# Altium schematic sheet Sheet1.SchDoc
size A; SheetNumber: 1; SheetTotal: 1
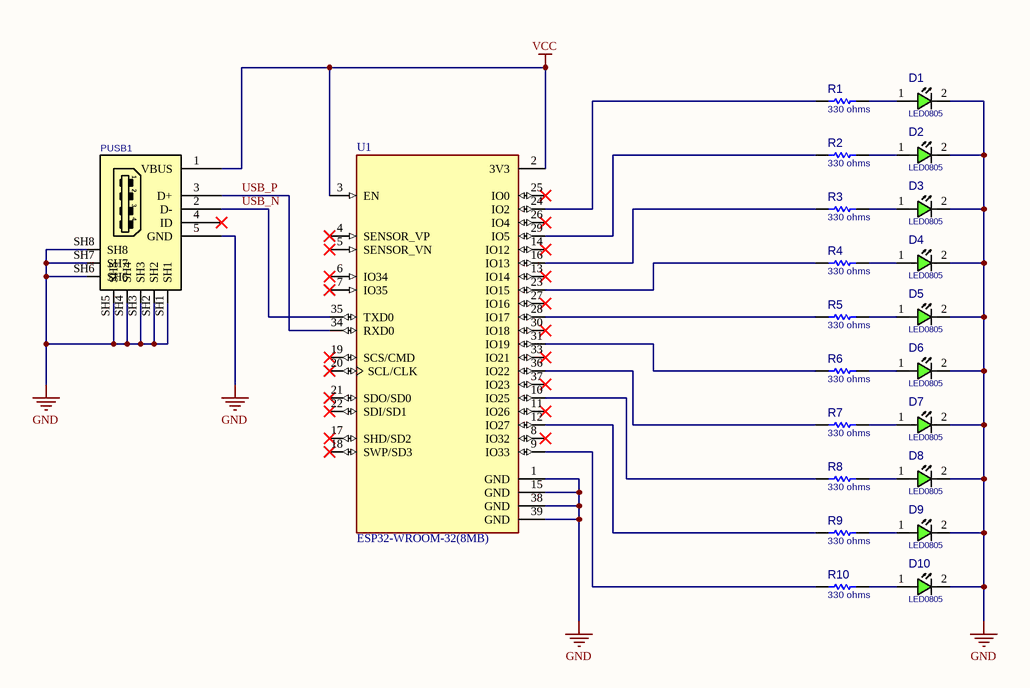
[diagram p0: Sheet1.SchDoc]

## Parts
D1  LED0805  [LED0805]
D2  LED0805  [LED0805]
D3  LED0805  [LED0805]
D4  LED0805  [LED0805]
D5  LED0805  [LED0805]
D6  LED0805  [LED0805]
D7  LED0805  [LED0805]
D8  LED0805  [LED0805]
D9  LED0805  [LED0805]
D10  LED0805  [LED0805]
PUSB1  CONN_USB_MICROB  [USB_MICRO_B_BM_SHS]  (value not drawn)
R1  330 ohms  [R0805]
R2  330 ohms  [R0805]
R3  330 ohms  [R0805]
R4  330 ohms  [R0805]
R5  330 ohms  [R0805]
R6  330 ohms  [R0805]
R7  330 ohms  [R0805]
R8  330 ohms  [R0805]
R9  330 ohms  [R0805]
R10  330 ohms  [R0805]
U1  ESP32-WROOM-32(8MB)  [MODULE_ESP32-WROOM-32(8MB)]

## Nets
GND: D1.2(CATHODE) D2.2(CATHODE) D3.2(CATHODE) D4.2(CATHODE) D5.2(CATHODE) D6.2(CATHODE) D7.2(CATHODE) D8.2(CATHODE) D9.2(CATHODE) D10.2(CATHODE) PUSB1.5(GND) PUSB1.SH1 PUSB1.SH2 PUSB1.SH3 PUSB1.SH4 PUSB1.SH5 PUSB1.SH6 PUSB1.SH7 PUSB1.SH8 U1.1(GND) U1.15(GND) U1.38(GND) U1.39(GND)
VCC: PUSB1.1(VBUS) U1.2(3V3) U1.3(EN)
USB_N: PUSB1.2(D-) U1.35(TXD0)
USB_P: PUSB1.3(D+) U1.34(RXD0)
NetD1_1: D1.1(ANODE) R1.2
NetD2_1: D2.1(ANODE) R2.2
NetD3_1: D3.1(ANODE) R3.2
NetD4_1: D4.1(ANODE) R4.2
NetD5_1: D5.1(ANODE) R5.2
NetD6_1: D6.1(ANODE) R6.2
NetD7_1: D7.1(ANODE) R7.2
NetD8_1: D8.1(ANODE) R8.2
NetD9_1: D9.1(ANODE) R9.2
NetD10_1: D10.1(ANODE) R10.2
NetR1_1: R1.1 U1.24(IO2)
NetR2_1: R2.1 U1.29(IO5)
NetR3_1: R3.1 U1.16(IO13)
NetR4_1: R4.1 U1.23(IO15)
NetR5_1: R5.1 U1.28(IO17)
NetR6_1: R6.1 U1.31(IO19)
NetR7_1: R7.1 U1.36(IO22)
NetR8_1: R8.1 U1.10(IO25)
NetR9_1: R9.1 U1.12(IO27)
NetR10_1: R10.1 U1.9(IO33)

Not connected (* = marked no-connect by the designer): PUSB1 4(ID)*; U1 4(SENSOR_VP)* 5(SENSOR_VN)* 6(IO34)* 7(IO35)* 8(IO32)* 11(IO26)* 13(IO14)* 14(IO12)* 17(SHD/SD2)* 18(SWP/SD3)* 19(SCS/CMD)* 20(SCL/CLK)* 21(SDO/SD0)* 22(SDI/SD1)* 25(IO0)* 26(IO4)* 27(IO16)* 30(IO18)* 33(IO21)* 37(IO23)*

## Library data of the parts
D1-D10 = LED_SMD_0805: LED, SMD, 0805; DESC: DESCRIPTION; MANF_P#: MANF_PART#; PARAM2: 2.2V; MANF: MANF; ASSEMBLY: ASSEMBLY; PRICE: PRICE; VALUE: LED0805
PUSB1 = CONN_USB_MICRO_B_BM_SHS: CONN, USB, MICRO B, R/A, SMD, BOTTOM MOUNT; MANF_P#: 47346-0001; MANF: Molex; MANF_P#2: HIROSE ZX62-AB-5PA; PARAM2: 30VAC; PARAM: 1.8A, -20~85oC; PRICE: 0.75$; VALUE: CONN_USB_MICROB
R1-R10 = RES_SMD_0805: RESISTOR, SMD; PARAM: -W; DESC: DESCRIPTION; DIST#: MOUSER; PARAM2: 1%; MANF_P#: -; MANF: -; ASSEMBLY: ASSEMBLY; PRICE: 100= 0.5$; VALUE: 330 ohms
U1 = ESP32-WROOM-32(8MB): Bluetooth, WiFi 802.11b/g/n, Bluetooth v4.2 +EDR, Class 1, 2 and 3 Transceiver Module 2.4GHz ~ 2.5GHz Antenna Not Included, U.FL Surface Mount; MF: Espressif Systems; Value: *; SnapEDA_Link: https://www.snapeda.com/parts/ESP32-WROOM-32%20(8MB)/Espressif+Systems/view-part/?ref=snap; Availability: Not in stock; Price: None; Package: Module Espressif Systems; Check_prices: https://www.snapeda.com/parts/ESP32-WROOM-32%20(8MB)/Espressif+Systems/view-part/?ref=eda; MP: ESP32-WROOM-32 (8MB)